# Altium project Robot_Controller.PrjPcb
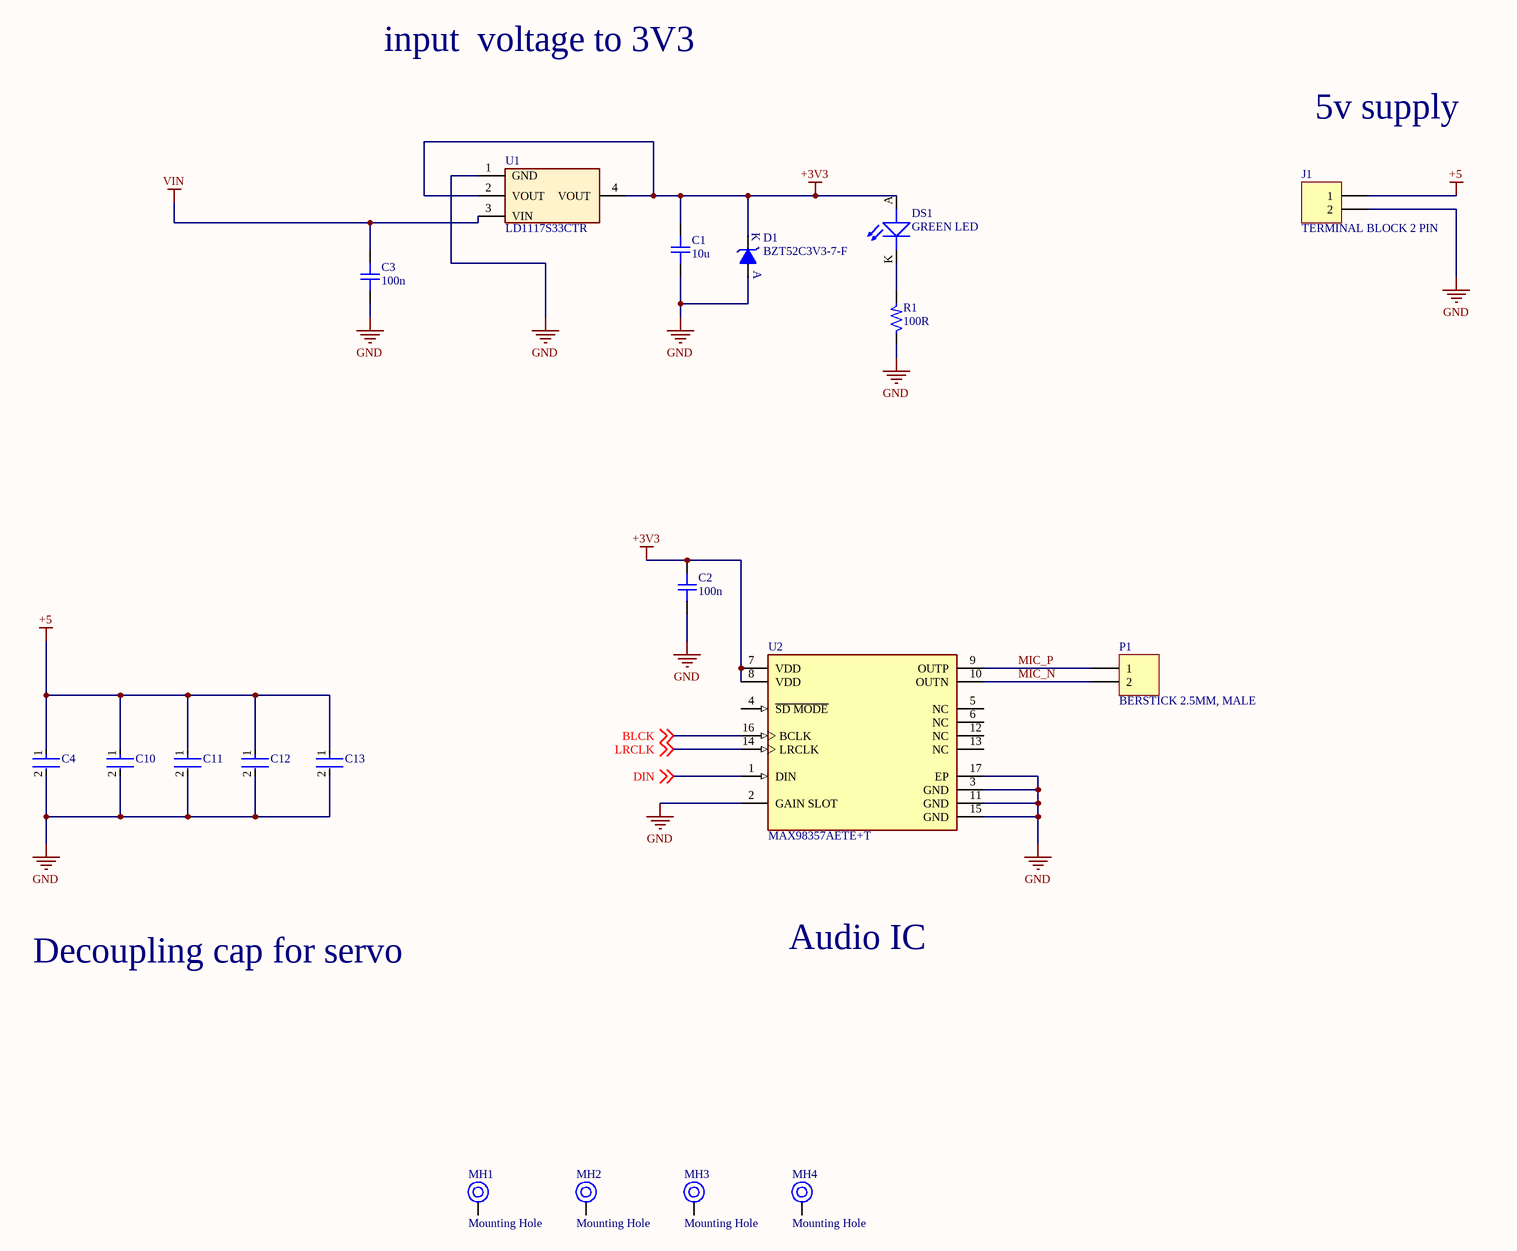
[diagram p0: power supply.SchDoc]
2 sheets, 51 parts. Net scope: global (net labels, ports and power ports of the same name join across sheets).
Board file: Robot_Controller.PcbDoc
Sheets:
  power supply.SchDoc
  MCU.SchDoc

## Sheet power supply.SchDoc
size A3; SheetNumber: 1; SheetTotal: 2

### Parts
C1  10u  [CAP_0603]
C2  100n  [CAP_0402]
C3  100n  [CAP_0402]
C4  C1210C107M9PACTU  [FP-C1210C107M9PACTU-MFG]  (value not drawn)
C10  C1210C107M9PACTU  [FP-C1210C107M9PACTU-MFG]  (value not drawn)
C11  C1210C107M9PACTU  [FP-C1210C107M9PACTU-MFG]  (value not drawn)
C12  C1210C107M9PACTU  [FP-C1210C107M9PACTU-MFG]  (value not drawn)
C13  C1210C107M9PACTU  [FP-C1210C107M9PACTU-MFG]  (value not drawn)
D1  BZT52C3V3-7-F  [DIO_SOD-123]
DS1  GREEN LED  [LED_0805]
J1  TERMINAL BLOCK 2 PIN  [CON2_P196_1729128_TH_ST]
MH1  Mounting Hole  [MOUNTING]
MH2  Mounting Hole  [MOUNTING]
MH3  Mounting Hole  [MOUNTING]
MH4  Mounting Hole  [MOUNTING]
P1  BERSTICK 2.5MM, MALE  [CON2_100_43D62_TH_ST]
R1  100R  [RES_0603]
U1  LD1117S33CTR  [SOT223_3]
U2  MAX98357AETE+T  [FP-T1633-4-MFG]

### Nets
+3V3: C1.2 C2.2 D1.K DS1.A(ANODE) U1.2(VOUT) U1.4(VOUT) U2.7(VDD) U2.8(VDD)
+5: C4.1 C10.1 C11.1 C12.1 C13.1 J1.1
GND: C1.1 C2.1 C3.1 C4.2 C10.2 C11.2 C12.2 C13.2 D1.A J1.2 R1.1 U1.1(GND) U2.2(GAIN_SLOT) U2.3(GND) U2.11(GND) U2.15(GND) U2.17(EP)
VIN: C3.2 U1.3(VIN)
BLCK: U2.16(BCLK) ; off-sheet BLCK
DIN: U2.1(DIN) ; off-sheet DIN
LRCLK: U2.14(LRCLK) ; off-sheet LRCLK
MIC_N: P1.2 U2.10(OUTN)
MIC_P: P1.1 U2.9(OUTP)
NetDS1_K: DS1.K(CATHODE) R1.2

Not connected (* = marked no-connect by the designer): MH1 1; MH2 1; MH3 1; MH4 1; U2 4(~{SD_MODE}) 5(NC) 6(NC) 12(NC) 13(NC)

### Notes on the sheet
- input  voltage to 3V3
- 5v supply
- Decoupling cap for servo
- Audio IC

### Library data of the parts
C1 = CAP_0603_10V: Capacitor SMD 0603 10V; Manufacturer: Samsung; Manufacturer Part Number: CL10A106KP8NNNC; LCSC: C19702
C2 C3 = CAP_0402_50V_1: Capacitor SMD 0402 50V; Manufacturer: Samsung; Manufacturer Part Number: CL05B104KO5NNNC; LCSC: C1525
C4 C10-C13 = CMP-2000-06018-2: CAP CER 100UF 6.3V X5R 1210; Dissipation Factor: 5%; Dielectric Material: Ceramic; Tolerance: 20%; Termination: SMD/SMT; REACH SVHC: No SVHC; Thickness: 0.11inch; Packaging: Tape and Reel; Series: C; Width: 2.5mm; Voltage Rating (DC): 6.3V; Voltage: 6.3V; Contact Plating: Tin; Package Quantity: 1; Case/Package: 1210; Min Operating Temperature: -55°C; Height: 2.5mm; Radiation Hardening: No; Capacitance: 100uF; Case Code (Metric): 3225; Depth: 2.5mm; Construction: Flat; Max Operating Temperature: 85°C; Number of Pins: 2; Mount: Surface Mount; Lead Free: Lead Free; RoHS Compliant: Yes; Voltage Rating: 6.3V; Dielectric: X5R; Length: 3.2mm; Case Code (Imperial): 1210
D1 = DIO-Z_3.3V-500mW-SOD123: Zener Diode 3.3V 500mW ±6% Surface Mount SOD-123; Manufacturer: Diodes Incorporated; Alternate Part Number-1: NA; Manufacturer Part Number: BZT52C3V3-7-F; Case/Package: SOD-123; Supplier-1: Digikey; Supplier Part Number-1: BZT52C3V3-FDICT-ND
DS1 = LED_GREEN-2.2-20mA-0805: Green 569nm LED Indication - Discrete 2.1V 0805 (2012 Metric); Manufacturer: Vishay Lite-On; Manufacturer Part Number: LTST-C171GKT; Alternate Part Number-1: NA; Case/Package: 0805; Supplier-1: SP ROAD; Supplier Part Number-1: LTST-C171GKT
J1 = CON-TB_2X1-196-ST-TH: 2 Pins, 1 Row 5mm Pitch, straight Connector, male; Manufacturer: Phoenix Contact; Manufacturer Part Number: MKDSN1,5/2; Alternate Part Number-1: NA; Case/Package: TH-CON; Supplier-1: SP ROAD; Supplier Part Number-1: MKDSN1,5/2
MH1-MH4 = MH_3.5H_6D: Manufacturer Part Number: NA; Case/Package: TH; Manufacturer: NA; Supplier-1: NA; Supplier Part Number-1: NA; Alternate Part Number-1: NA
P1 = CON-BS-PLG_2X1-100-ST-TH: 2 Pins, 1 Row 2.54mm Pitch, Straight bergstrip, Male; Manufacturer Part Number: NA; Manufacturer: Samtec; Case/Package: TH-CON; Supplier-1: SP ROAD; Supplier Part Number-1: NA; Alternate Part Number-1: NA
R1 = RES_100R-0.1W-1%-0603: 100 Ohms ±1% 0.1W, 1/10W Chip Resistor 0603 (1608 Metric) Thick Film; Manufacturer: Walsin; Manufacturer Part Number: WR06X1000FTL; Alternate Part Number-1: MR06X1000FTL; Case/Package: 0603; Supplier-1: SIRICOM; Supplier Part Number-1: WALSIN:WR06X1000FTL
U1 = REG_15V-3.3V-0.9A-12W-SOT223: Linear Voltage Regulator IC 1 Output 800mA SOT-223; Manufacturer: STMicroelectronics; Alternate Part Number-1: NA; Manufacturer Part Number: LD1117S33CTR; Case/Package: SOT223; Supplier-1: SP ROAD; Supplier Part Number-1: LD1117S33CTR
U2 = CMP-05698-000018-1: IC AMP CLASS D MONO 3.2W 16TQFN; Max Supply Voltage: 5.5V; Max Output Current: 1.6A; Voltage Gain: 15dB; Max Power Dissipation: 1.666W; Min Supply Voltage: 2.5V; Power Supply Rejection Ratio (PSRR): 77dB; Series: -; Contact Plating: Tin; Min Operating Temperature: -40°C; Packaging: Tape and Reel; Max Output Power: 3.2W; Mount: Surface Mount; Number of Pins: 16; RoHS Compliant: Yes; Max Operating Temperature: 85°C; Radiation Hardening: No

## Sheet MCU.SchDoc
size A3; SheetNumber: 2; SheetTotal: 2
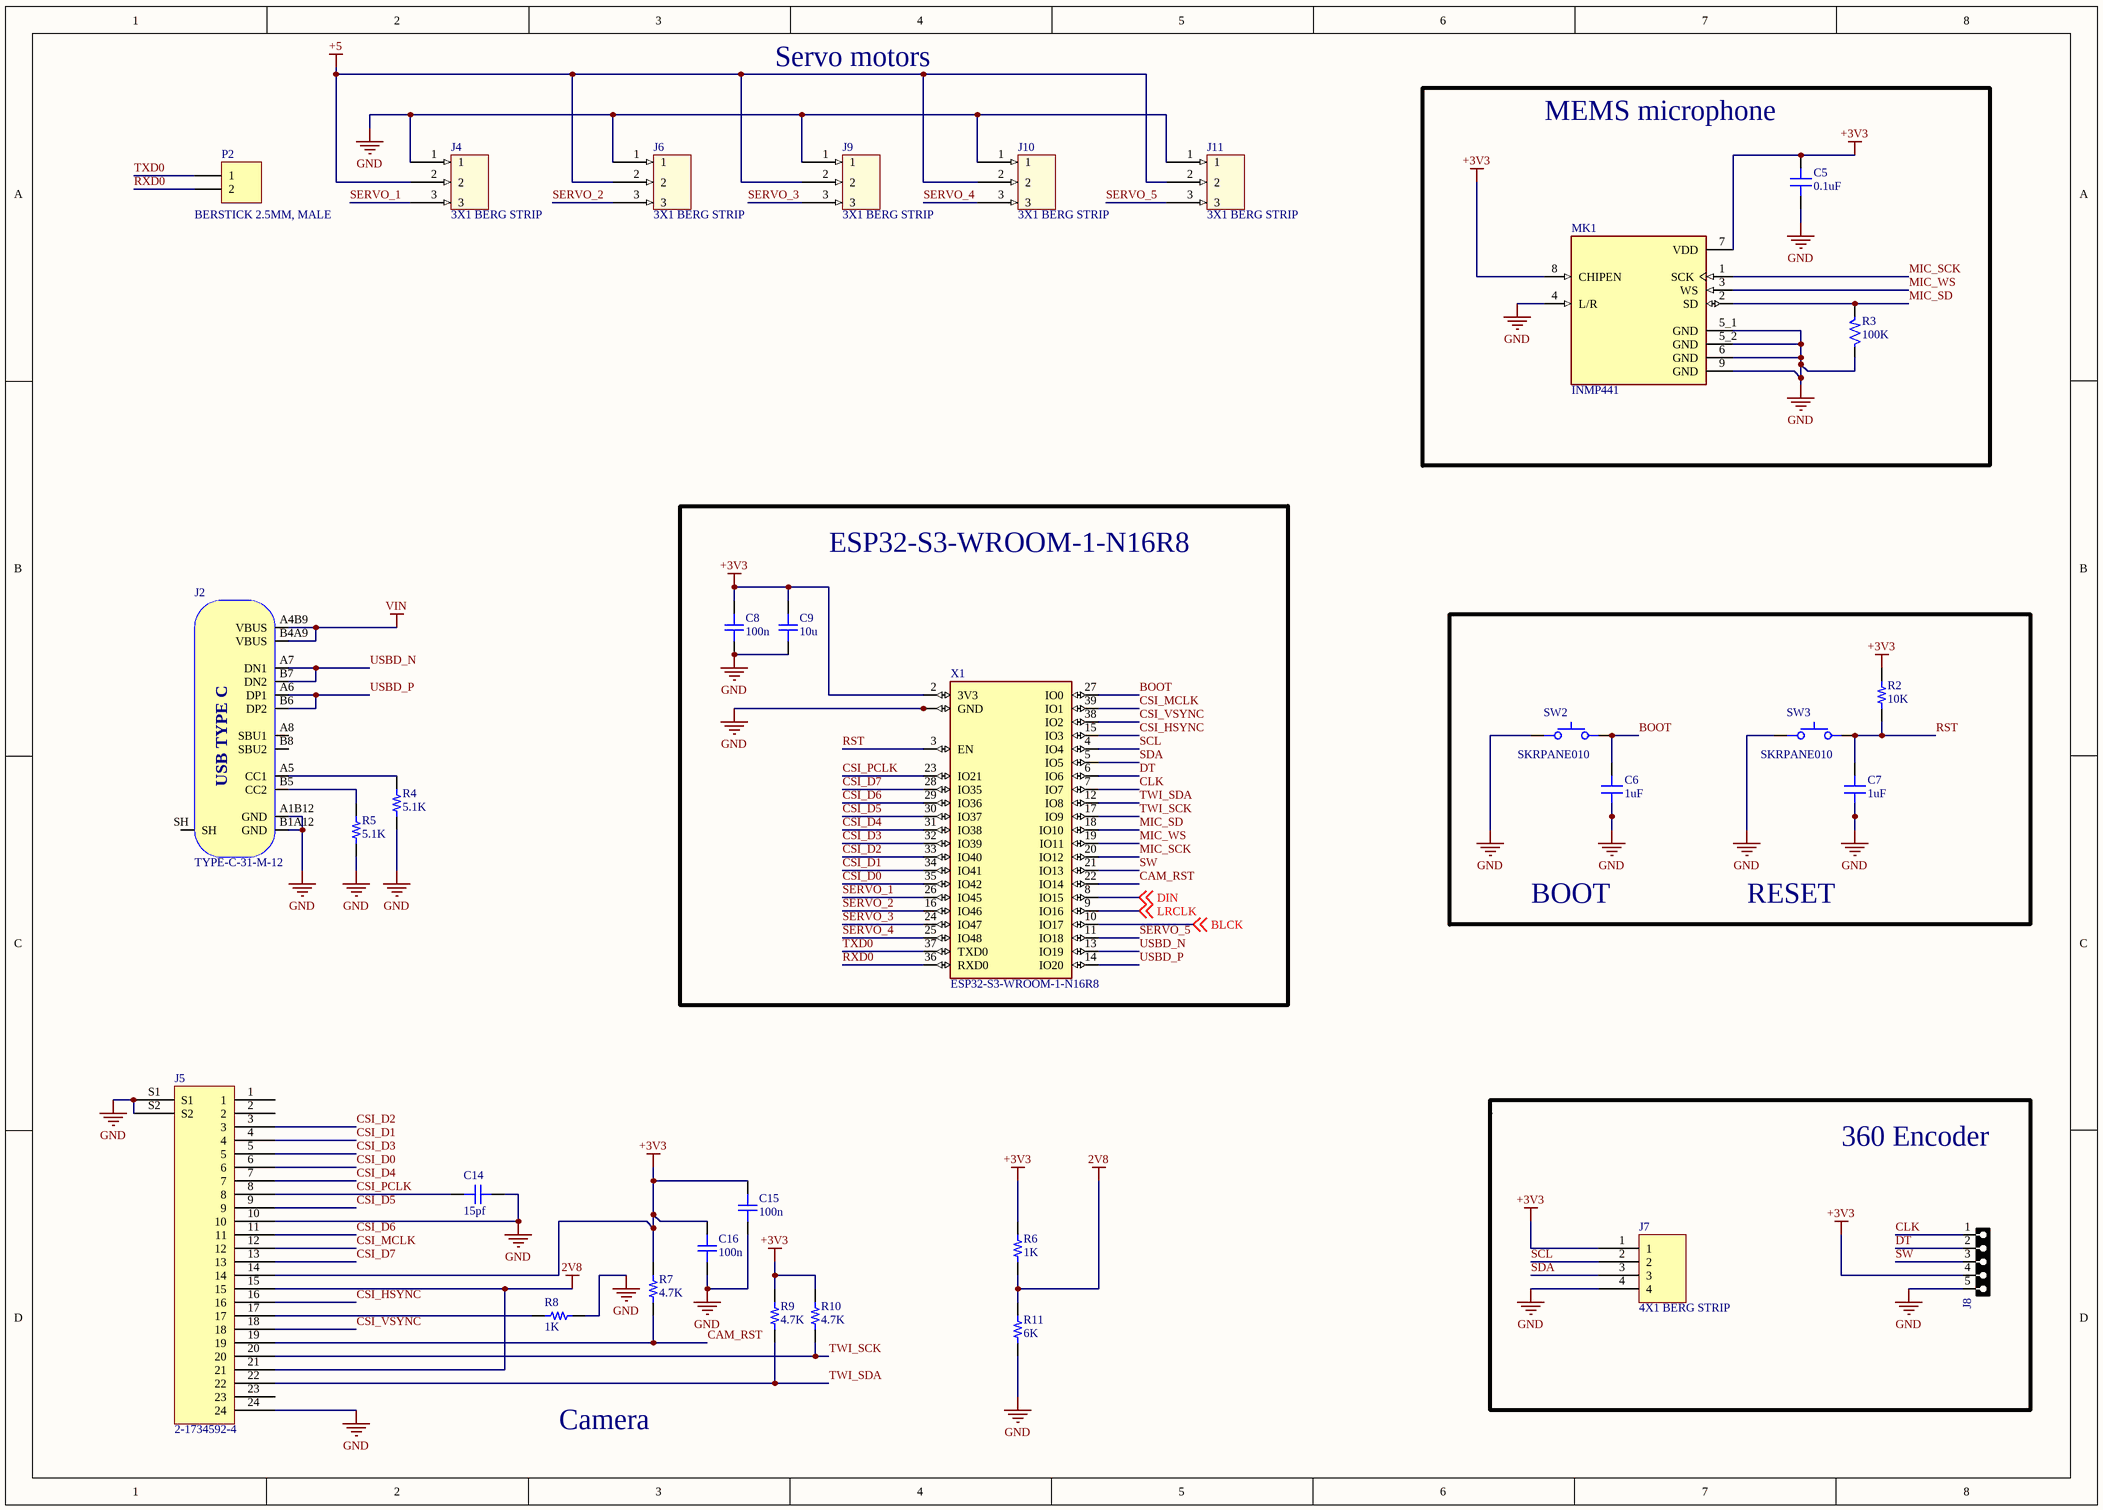
[diagram p1: MCU.SchDoc]

### Parts
C5  0.1uF  [CAP 0402_1005]
C6  1uF  [CAP 0402_1005]
C7  1uF  [CAP 0402_1005]
C8  100n  [CAP_0402]
C9  10u  [CAP_0603]
C14  15pf  [CAP_0402]
C15  100n  [CAP_0402]
C16  100n  [CAP_0402]
J2  TYPE-C-31-M-12  [TYPE-C-31-M-12]
J4  3X1 BERG STRIP  [CON3_100_40D72_TH_ST-MALE]
J5  2-1734592-4  [CON24_19_2-1734592-4_SMD_RA]
J6  3X1 BERG STRIP  [CON3_100_40D72_TH_ST-MALE]
J7  4X1 BERG STRIP  [CON4_100_40D72_TH_ST_MALE]
J8  HDRF5  [HDRLP_F_1X5]  (value not drawn)
J9  3X1 BERG STRIP  [CON3_100_40D72_TH_ST-MALE]
J10  3X1 BERG STRIP  [CON3_100_40D72_TH_ST-MALE]
J11  3X1 BERG STRIP  [CON3_100_40D72_TH_ST-MALE]
MK1  INMP441  [MIC_INMP441]
P2  BERSTICK 2.5MM, MALE  [CON2_100_43D62_TH_ST]
R2  10K  [RES 0402_1005]
R3  100K  [RES_0603]
R4  5.1K  [RES 0402_1005]
R5  5.1K  [RES 0402_1005]
R6  1K  [RES 0402_1005]
R7  4.7K  [RES 0402_1005]
R8  1K  [RES 0402_1005]
R9  4.7K  [RES 0402_1005]
R10  4.7K  [RES 0402_1005]
R11  6K  [RES 0402_1005]
SW2  SKRPANE010  [SKRPANE010]
SW3  SKRPANE010  [SKRPANE010]
X1  ESP32-S3-WROOM-1-N16R8  [ESP32S3WROOM1N8R2]

### Blocks framed on the sheet
MEMS microphone: C5 MK1 R3
ESP32-S3-WROOM-1-N16R8: C8 C9 X1
360 Encoder: J7 J8

### Nets
2V8: J5.15 J5.21 R6.1 R11.2
+3V3: C5.2 C8.2 C9.2 C15.2 C16.2 J5.14 J7.1 J8.4 MK1.7(VDD) MK1.8(CHIPEN) R2.2 R6.2 R7.2 R9.2 R10.2 X1.2(3V3)
+5: J4.2 J6.2 J9.2 J10.2 J11.2
GND: C5.1 C6.1 C7.1 C8.1 C9.1 C14.1 C15.1 C16.1 J2.A1B12(GND) J2.B1A12(GND) J4.1 J5.10 J5.24 J5.S1 J5.S2 J6.1 J7.4 J8.5 J9.1 J10.1 J11.1 MK1.4(L/R) MK1.5_1(GND) MK1.5_2(GND) MK1.6(GND) MK1.9(GND) R3.1 R4.1 R5.1 R8.1 R11.1 SW2.12 SW3.12 X1.1(GND) X1.40(GND) X1.41(GND) X1.42(GND) X1.43(GND) X1.44(GND) X1.45(GND) X1.46(GND) X1.47(GND) X1.48(GND) X1.49(GND)
VIN: J2.A4B9(VBUS) J2.B4A9(VBUS)
BLCK: X1.10(IO17) ; off-sheet BLCK
BOOT: C6.2 SW2.34 X1.27(IO0)
CAM_RST: J5.19 R7.1 X1.22(IO14)
CLK: J8.1 X1.7(IO7)
CSI_D0: J5.6 X1.35(IO42)
CSI_D1: J5.4 X1.34(IO41)
CSI_D2: J5.3 X1.33(IO40)
CSI_D3: J5.5 X1.32(IO39)
CSI_D4: J5.7 X1.31(IO38)
CSI_D5: J5.9 X1.30(IO37)
CSI_D6: J5.11 X1.29(IO36)
CSI_D7: J5.13 X1.28(IO35)
CSI_HSYNC: J5.16 X1.15(IO3)
CSI_MCLK: J5.12 X1.39(IO1)
CSI_PCLK: C14.2 J5.8 X1.23(IO21)
CSI_VSYNC: J5.18 X1.38(IO2)
DIN: X1.8(IO15) ; off-sheet DIN
DT: J8.2 X1.6(IO6)
LRCLK: X1.9(IO16) ; off-sheet LRCLK
MIC_SCK: MK1.1(SCK) X1.20(IO12)
MIC_SD: MK1.2(SD) R3.2 X1.18(IO10)
MIC_WS: MK1.3(WS) X1.19(IO11)
RST: C7.2 R2.1 SW3.34 X1.3(EN)
RXD0: P2.2 X1.36(RXD0)
SCL: J7.2 X1.4(IO4)
SDA: J7.3 X1.5(IO5)
SERVO_1: J4.3 X1.26(IO45)
SERVO_2: J6.3 X1.16(IO46)
SERVO_3: J9.3 X1.24(IO47)
SERVO_4: J10.3 X1.25(IO48)
SERVO_5: J11.3 X1.11(IO18)
SW: J8.3 X1.21(IO13)
TWI_SCK: J5.20 R10.1 X1.17(IO9)
TWI_SDA: J5.22 R9.1 X1.12(IO8)
TXD0: P2.1 X1.37(TXD0)
USBD_N: J2.A7(DN1) J2.B7(DN2) X1.13(IO19)
USBD_P: J2.A6(DP1) J2.B6(DP2) X1.14(IO20)
NetJ2_A5: J2.A5(CC1) R4.2
NetJ2_B5: J2.B5(CC2) R5.2
NetJ5_17: J5.17 R8.2

Not connected (* = marked no-connect by the designer): J2 A8(SBU1) B8(SBU2) SH; J5 1 2 23

### Notes on the sheet
- Servo motors
- BOOT
- RESET
- Camera
- (in symbol TYPE-C-31-M-12) USB TYPE C

### Library data of the parts
C5 = Cap 0402: SMT Capacitor; VALUE: 0.1uF
C6 C7 = Cap 0402: SMT Capacitor; VALUE: 100nF
C8 C15 C16 = CAP_0402_50V_1: as C2 on sheet power supply; LCSC: C1525
C9 = CAP_0603_10V: as C1 on sheet power supply; LCSC: C19702
C14 = CAP_0402_50V_2: Capacitor SMD 0402 50V; Manufacturer: Samsung; Manufacturer Part Number: CL05C100JB5NNNC; LCSC: C32949
J2 = TYPE-C-31-M-12: USB Type C Connector Horizontal SMT; Manufacturer: Koren Hroparts; Manufacturer Part Number: TYPE-C-31-M-12; LCSC: C165948
J4 J6 J9-J11 = CON-BS-PLG_3X1-100-ST-TH: 3 Pins, 1 Row 2.54mm Pitch, Straight bergstrip, Male; Manufacturer: NA; Manufacturer Part Number: RKI-1140; Case/Package: TH-CON; Supplier-1: SP ROAD; Supplier Part Number-1: NA; Alternate Part Number-1: NA
J5 = CON-PLG-FPC_24X1-19-RA-BC-SMD: FFC & FPC Connectors FPC CONN 0.5MM PITCH B/C 24P; Manufacturer: TE Connectivity; Mating Part Number: 0151660259; Alternate Part Number-1: NA; Manufacturer Part Number: 2-1734592-4; Case/Package: SMD; Supplier-1: Mouser; Supplier Part Number-1: 571-2-1734592-4
J7 = CON-BS-PLG_4X1-100-ST-TH: 4 Pins, 1 Row 2.54mm Pitch, Straight bergstrip, Male; Manufacturer: NA; Manufacturer Part Number: NA; Case/Package: TH-CON; Supplier-1: SP ROAD; Supplier Part Number-1: NA; Alternate Part Number-1: NA
J8 = HDRLP_F_1X5: CONN, HEADER, Male, pitch: 2.54mm, 5POS; VALUE: HDRF5
MK1 = INMP441: EVAL BOARD MEMS MIC INMP441; MF: TDK InvenSense; SnapEDA_Link: https://www.snapeda.com/parts/INMP441/TDK+InvenSense/view-part/?ref=snap; Package: None; Value: *; MP: INMP441; Check_prices: https://www.snapeda.com/parts/INMP441/TDK+InvenSense/view-part/?ref=eda
P2 = CON-BS-PLG_2X1-100-ST-TH: as P1 on sheet power supply; Case/Package: TH-CON; Supplier-1: SP ROAD; Supplier Part Number-1: NA; Alternate Part Number-1: NA
R2 R4 R5 R7 R9-R11 = Res 0402: SMT Resistor; VALUE: 1K
R3 = RES_100K-0.1W-1%-0603: 100 kOhms ±1% 0.1W, 1/10W Chip Resistor 0603 (1608 Metric) Automotive AEC-Q200 Thick Film; Manufacturer: Stackpole Electronics; Manufacturer Part Number: RMCF0603FT100K; Alternate Part Number-1: NA; Case/Package: 0603; Supplier-1: Arrow; Supplier Part Number-1: RMCF0603FT100K
R6 R8 = Res 0402: SMT Resistor; VALUE: 1K
SW2 SW3 = SKRPANE010: Tactile Switch SMD SPST; Manufacturer: Alps Alpine; Manufacturer Part Number: SKRPANE010; LCSC: C470426
X1 = ESP32-S3-WROOM-1-N16R8: Bluetooth, WiFi 802.11b/g/n, Bluetooth v5.0 Transceiver Module 2.4GHz PCB Trace Surface Mount; MF: Espressif Systems; SnapEDA_Link: https://www.snapeda.com/parts/ESP32-S3-WROOM-1-N16R8/Espressif+Systems/view-part/?ref=snap; Package: NON STANDARD Espressif Systems; Value: *; MP: ESP32-S3-WROOM-1-N16R8; Check_prices: https://www.snapeda.com/parts/ESP32-S3-WROOM-1-N16R8/Espressif+Systems/view-part/?ref=eda

## Nets that join several sheets
+3V3: power supply (8 pins), MCU (16 pins)
+5: power supply (6 pins), MCU (5 pins)
GND: power supply (17 pins), MCU (44 pins)
VIN: power supply (C3.2 U1.3), MCU (J2.A4B9 J2.B4A9)
BLCK: power supply (U2.16), MCU (X1.10)
DIN: power supply (U2.1), MCU (X1.8)
LRCLK: power supply (U2.14), MCU (X1.9)